# EAGLE design tx-slim-2.4g (EAGLE 9.5.2)
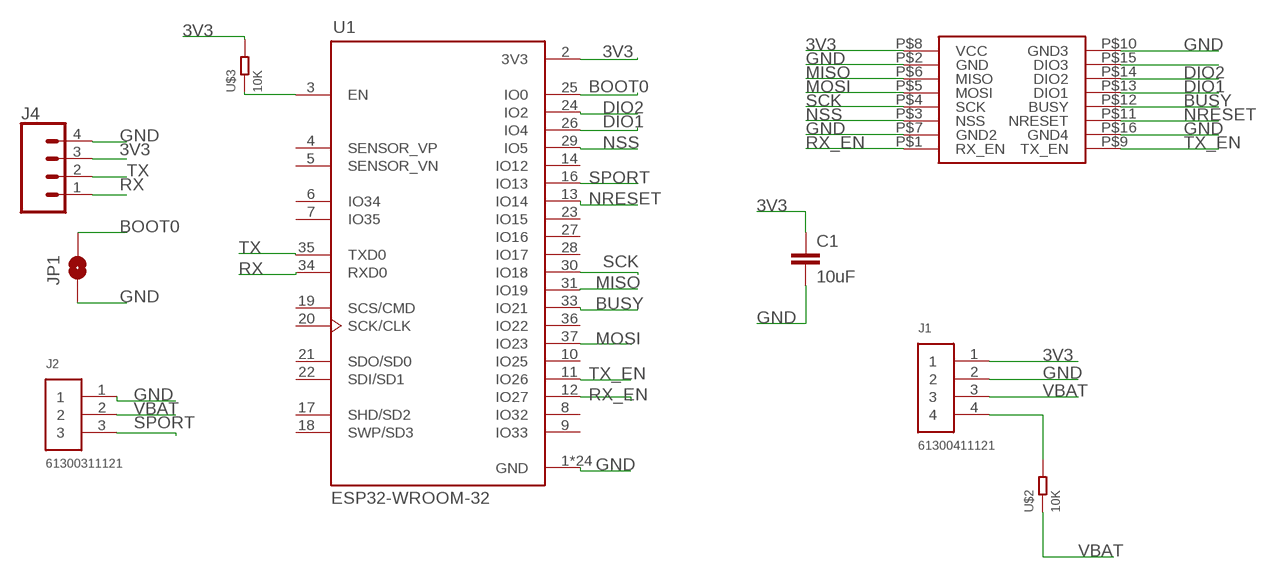
[diagram p0: schematic, sheet 1]

## Parts
C1  10uF  10UF-1210-50V-20%  [1210]
J1  61300411121  [61300411121]
J2  61300311121  [61300311121]
J4  CONN_04SMD_RA_FEMALE  [1X04_SMD_RA_FEMALE]
JP1  JUMPER-SMT_2_NO_NO-SILK  [SMT-JUMPER_2_NO_NO-SILK]
U1  ESP32-WROOM-32  [MODULE_ESP32-WROOM-32]
U$1  E28  [E28]
U$2  10K  SMD-RES-10K-1%-1/8W(0805)  [R0805]
U$3  10K  SMD-RES-10K-1%-1/8W(0805)  [R0805]

## Nets
3V3 [power]: C1.1 J1.1 J4.3 U1.2(3V3) U$1.P$8(VCC) U$3.2
BOOT0: JP1.2 U1.25(IO0)
BUSY: U1.33(IO21) U$1.P$12(BUSY)
DIO1: U1.26(IO4) U$1.P$13(DIO1)
DIO2: U1.24(IO2) U$1.P$14(DIO2)
GND [power]: C1.2 J1.2 J2.1 J4.4 JP1.1 U1.1(GND) U1.15(GND) U1.38(GND) U1.39_1(GND) U1.39_2(GND) U1.39_3(GND) U1.39_4(GND) U1.39_5(GND) U1.39_6(GND) U1.39_7(GND) U1.39_8(GND) U1.39_9(GND) U1.39_10(GND) U1.39_11(GND) U1.39_12(GND) U1.39_13(GND) U1.39_14(GND) U1.39_15(GND) U1.39_16(GND) U1.39_17(GND) U1.39_18(GND) U1.39_19(GND) U1.39_20(GND) U1.39_21(GND) U$1.P$2(GND) U$1.P$7(GND2) U$1.P$10(GND3) U$1.P$16(GND4)
MISO: U1.31(IO19) U$1.P$6(MISO)
MOSI: U1.37(IO23) U$1.P$5(MOSI)
N$4: J1.4 U$2.2
N$5: U1.3(EN) U$3.1
N$11: U$1.P$15(DIO3)
NRESET: U1.13(IO14) U$1.P$11(NRESET)
NSS: U1.29(IO5) U$1.P$3(NSS)
RX: J4.1 U1.34(RXD0)
RX_EN: U1.12(IO27) U$1.P$1(RX_EN)
SCK: U1.30(IO18) U$1.P$4(SCK)
SPORT: J2.3 U1.16(IO13)
TX: J4.2 U1.35(TXD0)
TX_EN: U1.11(IO26) U$1.P$9(TX_EN)
VBAT [power]: J1.3 J2.2 U$2.1
Unconnected: U1.4(SENSOR_VP) U1.5(SENSOR_VN) U1.6(IO34) U1.7(IO35) U1.8(IO32) U1.9(IO33) U1.10(IO25) U1.14(IO12) U1.17(SHD/SD2) U1.18(SWP/SD3) U1.19(SCS/CMD) U1.20(SCK/CLK) U1.21(SDO/SD0) U1.22(SDI/SD1) U1.23(IO15) U1.27(IO16) U1.28(IO17) U1.36(IO22)

## Library data of the parts
C1 = SparkFun-Capacitors:10UF: 10.0µF ceramic capacitors A capacitor is a passive two-terminal electrical component used to store electrical energy temporarily in an electric field.; PROD_ID: CAP-09824
J1 = Headers:61300411121: CONN HEADER VERT 4POS 2.54MM Manufacturer's datasheet <https://katalog.we-online.de/em/datasheet/6130xx11121.pdf>; CREATED_BY: PCBLayout.com; DIGI_KEY_PART_NUMBER: 732-5317-ND; MANUFACTURER: Wurth Electronics Inc.; MPN: 61300411121
J2 = Headers:61300311121: CONN HEADER VERT 3POS 2.54MM Manufacturer's datasheet <https://katalog.we-online.de/em/datasheet/6130xx11121.pdf>; CREATED_BY: PCBLayout.com; DIGI_KEY_PART_NUMBER: 732-5316-ND; MANUFACTURER: Wurth Electronics Inc.; MPN: 61300311121
J4 = SparkFun-Connectors:CONN_04: Multi connection point. Often used as Generic Header-pin footprint for 0.1 inch spaced/style header connections On any of the 0.1 inch spaced packages, you can populate with these: Break Away Headers - Straight <https://www.sparkfun.com/products/116> (PRT-00116) Break Away Male Headers - Right Angle <https://www.sparkfun.com/products/553> (PRT-00553) Female Headers <https://www.sparkfun.com/products/115> (PRT-00115) Break Away Headers - Machine Pin <https://www.sparkfun.com/products/117> (PRT-00117) Break Away Female Headers - Swiss Machine Pin <https://www.sparkfun.com/products/743> (PRT-00743) For SCREWTERMINALS and SPRING TERMINALS visit here: Screw Terimnals on SparkFun.com <https://www.sparkfun.com/search/results?term=Screw+Terminals> (5mm/3.5mm/2.54mm spacing) This device is also useful as a general connection point to wire up your design to another part of your project. Our various solder wires solder well into these plated through hole pads. Hook-Up Wire - Assortment (Stranded, 22 AWG) <https://www.sparkfun.com/products/11375> (PRT-11375) Hook-Up Wire - Assortment (Solid Core, 22 AWG) <https://www.sparkfun.com/products/11367> (PRT-11367) View the entire wire category on our website here <https://www.sparkfun.com/categories/141> Special notes: Molex polarized connector foot print use with SKU : PRT-08231 with associated crimp pins and housings. 1MM SMD Version SKU: PRT-10208; PROD_ID: CONN-12382
JP1 = SparkFun-Jumpers:JUMPER-SMT_2_NO: Normally open jumper This jumper has two pads in close proximity to each other. Apply solder to close the connection. Round pads are easier to solder for beginners, but are a lot larger. SparkFun Product that uses the round pads: SparkFun EL Sequencer <https://www.sparkfun.com/products/12781>
U1 = ESP32-WROOM-32:ESP32-WROOM-32: Bluetooth, WiFi Transceiver Module 2.4GHz ~ 2.5GHz Surface Mount Check prices <https://snapeda.com/parts/ESP32-WROOM-32/Espressif%20Systems/view-part/?ref=eda>; AVAILABILITY: Warning; DESCRIPTION: Bluetooth, WiFi Transceiver Module 2.4GHz ~ 2.5GHz Surface Mount; DIGIKEY-PURCHASE-URL: https://snapeda.com/shop?store=DigiKey&id=2753322; MF: Espressif Systems; MP: ESP32-WROOM-32; PACKAGE: Module Espressif Systems; PRICE: None
U$1 = e28:E28
U$2 U$3 = OPL_Resistor:SMD-RES-10K-1%-1/8W(0805): 301012152; MPN: RC0805FR-0710KL

## Net classes
0 default: width 0.203 mm
1 power: width 0.406 mm

## Board
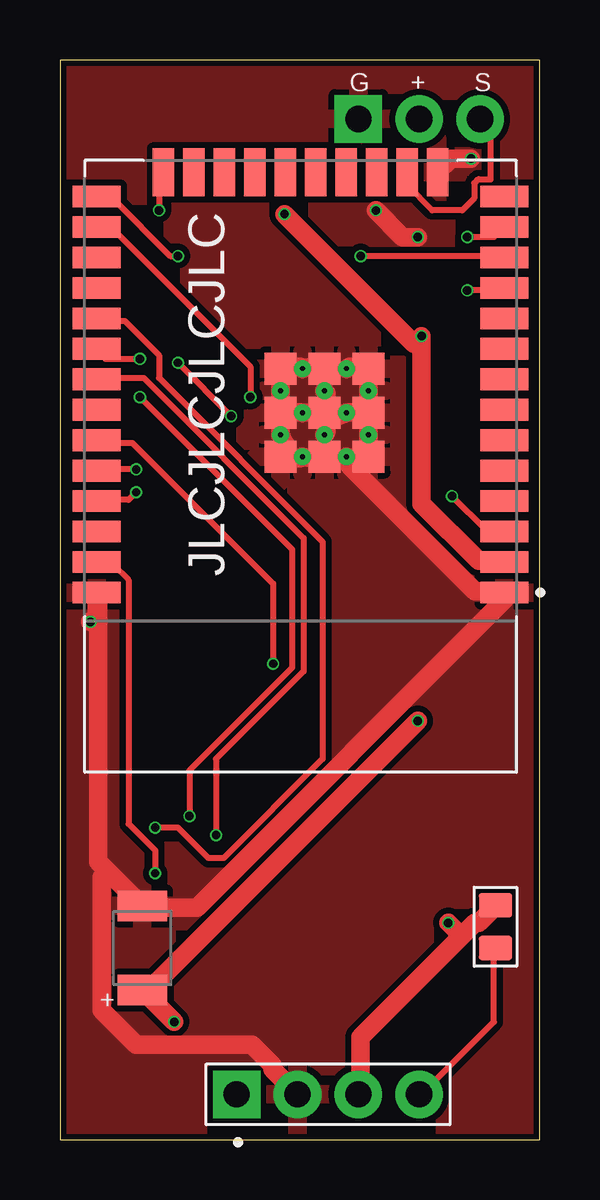
[diagram p1: board, top side]
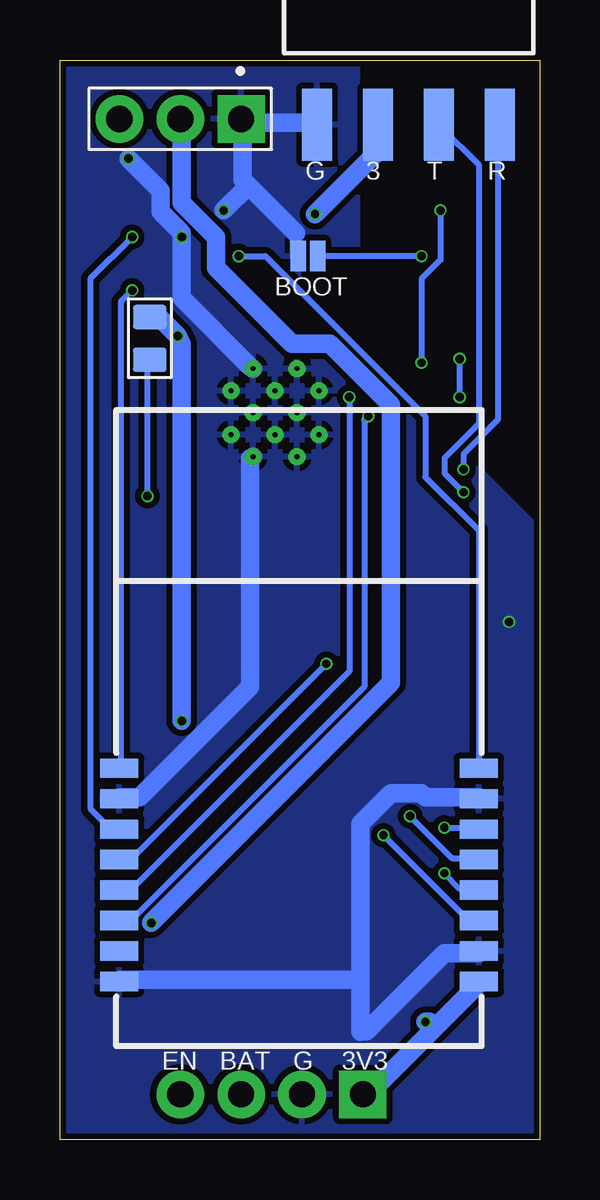
[diagram p2: board, bottom side, seen from below]

Size 20 x 45 mm. Coordinates in mm from the lower left corner, seen from the top.
Outline: 0,0 20,0 20,45 0,45 0,0
Copper layers (1*16): Top 0.035mm / dielectric 1.6mm / Bottom 0.035mm
Design rules "jlcpcb-2layers": minimum track width 5mil, minimum drill 0.3mm, track to track 5mil, track to pad 5mil, pad to pad 5mil, via to via 5mil, smd to smd 5mil, copper to edge 0.2mm, drill to drill 6mil, minimum pad ring 10mil, minimum via ring 3mil, stop-mask expansion 4mil, vias tented up to drill 0mil, thermal gap 10mil

### Footprints (pad centres in the part's own frame; a part is rotated, then mirrored left to right if it is on the bottom)
1210 = smd 1.27 x 2.06: 1 -1.755,0; 2 1.755,0
61300411121 = drill 1.1 square: 1 -3.81,0 | drill 1.1: 2 -1.27,0; 3 1.27,0; 4 3.81,0
61300311121 = drill 1.1 square: 1 -2.54,0 | drill 1.1: 2 0,0; 3 2.54,0
1X04_SMD_RA_FEMALE = smd 1.25 x 3: 1 -3.81,7.225; 2 -1.27,7.225; 3 1.27,7.225; 4 3.81,7.225
SMT-JUMPER_2_NO_NO-SILK = smd 0.635 x 1.27: 1 -0.406,0; 2 0.406,0
MODULE_ESP32-WROOM-32 = smd 2 x 0.9: 1 -8.5,5.26; 2 -8.5,3.99; 3 -8.5,2.72; 4 -8.5,1.45; 5 -8.5,0.18; 6 -8.5,-1.09; 7 -8.5,-2.36; 8 -8.5,-3.63; 9 -8.5,-4.9; 10 -8.5,-6.17; 11 -8.5,-7.44; 12 -8.5,-8.71; 13 -8.5,-9.98; 14 -8.5,-11.25; 25 8.5,-11.25; 26 8.5,-9.98; 27 8.5,-8.71; 28 8.5,-7.44; 29 8.5,-6.17; 30 8.5,-4.9; 31 8.5,-3.63; 32 8.5,-2.36; 33 8.5,-1.09; 34 8.5,0.18; 35 8.5,1.45; 36 8.5,2.72; 37 8.5,3.99; 38 8.5,5.26 | smd 0.9 x 2: 15 -5.715,-12.25; 16 -4.445,-12.25; 17 -3.175,-12.25; 18 -1.905,-12.25; 19 -0.635,-12.25; 20 0.635,-12.25; 21 1.905,-12.25; 22 3.175,-12.25; 23 4.445,-12.25; 24 5.715,-12.25 | smd 1.33 x 1.33: 39_1 -2.835,-0.405; 39_2 -1,-0.405; 39_3 0.835,-0.405; 39_4 -2.835,-2.24; 39_5 -1,-2.24; 39_6 0.835,-2.24; 39_7 -2.835,-4.075; 39_8 -1,-4.075; 39_9 0.835,-4.075 | drill 0.2 pad 0.3: 39_10 -1.917,-0.405; 39_11 -0.083,-0.405; 39_12 -2.835,-1.323; 39_13 -1,-1.323; 39_14 0.835,-1.323; 39_15 -1.917,-2.24; 39_16 -0.083,-2.24; 39_17 -2.835,-3.158; 39_18 -1,-3.158; 39_19 0.835,-3.158; 39_20 -1.917,-4.075; 39_21 -0.083,-4.075
E28 = smd 1.6 x 0.8: P$1 -7.5,-4.445; P$2 -7.5,-3.175; P$3 -7.5,-1.905; P$4 -7.5,-0.635; P$5 -7.5,0.635; P$6 -7.5,1.905; P$7 -7.5,3.175; P$8 -7.5,4.445; P$9 7.5,-4.445; P$10 7.5,-3.175; P$11 7.5,-1.905; P$12 7.5,-0.635; P$13 7.5,0.635; P$14 7.5,1.905; P$15 7.5,3.175; P$16 7.5,4.445
R0805 = smd 1.397 x 1.016: 1 0,0.889; 2 0,-0.889

### Placement (x,y rotation side)
C1  3.43,8 90 top
J1  11.18,1.91 0 top
J2  14.99,42.55 180 bottom
J4  5.46,49.53 180 bottom
JP1  9.65,36.83 0 bottom
U1  10.03,28.07 180 top
U$1  10.03,11.05 180 bottom
U$2  18.16,8.89 0 top
U$3  16.26,33.4 180 bottom

### Tracks (layer width: path | path; a pad name or v marks a point on that pad's centre or on a via)
3V3  (via drill 0.35)
  Top 0.762: v4.76,4.92 3.49,6.19 C1.1 3.81,6.35 v14.92,17.46 | 15.08,33.18 15.08,26.51 17.46,24.13 18.41,24.13 U1.2 | 15.08,33.18 v15.08,33.5 | v9.37,38.58 14.76,33.18 15.08,33.18
  Bottom 0.762: 4.37,4.68 7.14,1.91 J1.1 | 4.37,4.68 2.54,6.51 U$1.P$8 | v4.76,4.92 4.6,4.92 4.37,4.68 | U$3.2 15.88,34.29 v15.08,33.5 14.92,33.18 v14.92,17.46 | v9.37,38.58 6.83,41.12 6.83,42.23 J4.3
BOOT0  (via drill 0.35)
  Top 0.254: v4.92,36.83 4.6,36.83 2.22,39.21 1.59,39.21 U1.25
  Bottom 0.254: v4.92,36.83 JP1.2
BUSY  (via drill 0.35)
  Top 0.254: v8.89,19.84 8.89,23.18 3.02,29.05 1.59,29.05 U1.33
  Bottom 0.254: v8.89,19.84 16.99,11.75 17.46,11.75 U$1.P$12
DIO1  (via drill 0.35)
  Top 0.254: v7.94,30.96 7.94,32.23 2.22,37.94 1.59,37.94 U1.26
  Bottom 0.254: v7.94,30.96 7.94,19.53 16.99,10.48 17.46,10.48 U$1.P$13
DIO2  (via drill 0.35)
  Top 0.254: v4.92,32.38 v7.14,30.16 | v4.13,38.73 4.13,40.01 4.29,40.16 U1.24
  Bottom 0.254: v7.14,30.16 7.3,30 7.3,18.89 16.99,9.21 17.46,9.21 U$1.P$14 | v4.92,32.38 4.92,35.88 4.13,36.67 v4.13,38.73
GND  (via drill 0.35)
  Top 0.762: 1.98,11.19 3.33,9.84 C1.2 3.81,9.68 5.71,9.68 18.57,22.54 U1.1 18.41,22.86 17.3,22.86 12.06,28.1 12.06,28.42 | 1.98,11.19 1.59,11.59 1.59,22.7 U1.38 1.53,21.85 v1.27,21.59 | U1.39_5 11.11,30.16 11.11,29.53 U1.39_13 | U1.39_18 11.11,31.11 11.11,30.64 U1.39_5 | U1.39_20 12.06,32.23 12.86,32.23 U1.39_7 12.86,31.91 12.86,31.59 U1.39_17 12.86,31.11 12.86,30.64 U1.39_4 | U1.39_4 12.86,30.16 12.86,29.53 U1.39_12 12.86,29.05 12.86,28.73 U1.39_1 12.86,28.42 12.06,28.42 | U1.39_4 12.54,30.32 12.06,30.32 U1.39_15 11.59,30.16 11.43,30.16 U1.39_5 | U1.39_8 10.95,32.23 10.48,32.23 U1.39_21 10,32.23 9.21,32.23 U1.39_9 9.21,31.91 9.21,31.59 U1.39_19 9.21,31.11 9.21,30.64 U1.39_6 | U1.39_2 10.95,28.42 10.48,28.42 U1.39_11 10,28.42 9.21,28.42 U1.39_3 9.37,28.73 9.37,29.05 U1.39_14 9.21,29.53 9.21,30.16 U1.39_6 | U1.39_6 9.53,30.32 10,30.32 U1.39_16 10.48,30.32 10.64,30.32 U1.39_5 | 12.06,28.42 U1.39_10 | 1.98,11.19 1.75,10.95 1.75,5.4 3.17,3.97 8,3.97 8.86,3.1 8.86,2.95 J1.2 | v14.92,37.62 14.29,37.62 v13.18,38.73 | v17.14,40.89 16.32,40.89 U1.15
  Bottom 0.508: JP1.1 10.16,36.93 10.16,37.78
  Bottom 0.762: U$1.P$7 2.54,7.78 3.97,7.78 7.22,4.52 7.46,4.76 | 7.46,4.76 7.46,6.67 | 7.46,6.67 7.46,13.18 6.19,14.45 4.92,14.45 4.76,14.29 2.54,14.29 U$1.P$2 | 7.46,6.67 17.46,6.67 U$1.P$16 | 12.14,39.77 12.38,40.01 12.38,42.55 J2.1 12.06,42.39 9.37,42.39 J4.4 | 10.16,37.78 12.14,39.77 | 12.14,39.77 v13.18,38.73 | U$1.P$10 17.46,14.29 16.67,14.29 12.06,18.89 12.06,28.42 U1.39_10 | U1.39_20 12.06,32.23 14.92,35.08 v14.92,37.62 14.92,37.8 15.81,38.68 15.81,39.56 v17.14,40.89 | J1.2 9.91,2.06 | 7.46,4.51 7.46,4.76
  pour Bottom (isolate 0.254): 2.54,27.94 -2.54,22.86 -2.54,-1.27 21.59,-1.27 21.59,45.72 7.62,45.72 7.62,33.02
  pour Top (isolate 0.254): 0,44.45 0,0 20.32,0 20.32,44.45
MISO  (via drill 0.35)
  Top 0.254: v6.51,12.7 6.51,15.88 10.16,19.53 10.16,25.08 3.49,31.75 1.59,31.75 U1.31
  Bottom 0.254: v6.51,12.7 3.02,9.21 2.54,9.21 U$1.P$6
MOSI  (via drill 0.35)
  Top 0.254: v3.97,11.11 3.97,12.06 2.86,13.18 2.86,23.34 2.22,23.97 1.59,23.97 U1.37
  Bottom 0.254: v3.97,11.11 3.33,10.48 2.54,10.48 U$1.P$5
N$4
  Top 0.254: U$2.2 18.1,7.94 18.1,4.92 15.08,1.91 J1.4
N$5  (via drill 0.35)
  Top 0.254: v16.35,26.83 17.78,25.4 18.41,25.4 U1.3
  Bottom 0.254: v16.35,26.83 16.35,32.38 U$3.1
NRESET  (via drill 0.35)
  Top 0.254: v16.99,37.62 18.1,37.62 18.41,37.94 U1.13
  Bottom 0.254: v16.99,37.62 18.73,35.88 18.73,13.81 17.94,13.02 17.62,13.02 U$1.P$11
NSS  (via drill 0.35)
  Top 0.254: v3.97,13.02 4.92,13.02 6.19,11.75 6.83,11.75 10.95,15.88 10.95,24.92 4.13,31.75 4.13,32.7 2.7,34.13 1.59,34.13 U1.29
  Bottom 0.254: v3.97,13.02 2.54,13.02 U$1.P$3
RX  (via drill 0.35)
  Top 0.254: v3.17,27.94 1.59,27.94 U1.34
  Bottom 0.254: v3.17,27.94 3.17,28.57 1.75,30 1.75,42.23 J4.1
RX_EN  (via drill 0.35)
  Top 0.254: v12.54,36.83 18.41,36.83 U1.12
  Bottom 0.254: v12.54,36.83 11.43,36.83 4.76,30.16 4.76,27.62 2.54,25.4 2.54,15.56 U$1.P$1
SCK  (via drill 0.35)
  Top 0.254: v5.4,13.49 5.4,15.4 9.68,19.68 9.68,24.61 v3.33,30.96 | v3.33,32.54 1.91,32.54 1.59,32.86 U1.30
  Bottom 0.254: v5.4,13.49 3.65,11.75 2.54,11.75 U$1.P$4 | v3.33,32.54 v3.33,30.96
SPORT
  Top 0.254: J2.3 17.46,42.55 17.96,42.04 17.96,40.02 17.78,40.02 17.5,40.02 17.43,40.02 17.27,39.87 17.27,39.23 16.77,38.73 15.52,38.73 14.51,39.75 14.48,39.75 U1.16
TX  (via drill 0.35)
  Top 0.254: v3.17,26.99 2.86,26.67 1.59,26.67 U1.35
  Bottom 0.254: v3.17,26.99 3.97,27.78 3.97,28.42 2.54,29.84 2.54,40.64 4.13,42.23 J4.2
TX_EN  (via drill 0.35)
  Top 0.254: v16.99,35.4 18.41,35.4 U1.11
  Bottom 0.254: v16.99,35.4 17.46,34.92 17.46,15.56 U$1.P$9
VBAT  (via drill 0.35)
  Top 0.762: 16.75,8.49 12.54,4.29 12.54,1.91 J1.3 | 16.75,8.49 17.3,9.05 17.46,9.05 18.1,9.68 U$2.1 | 16.75,8.49 v16.19,9.05
  Bottom 0.762: v16.19,9.05 6.19,19.05 6.19,30.64 8.73,33.18 10.32,33.18 13.49,36.35 13.49,37.62 14.92,39.05 14.92,42.55 J2.2

### Text on the board
tNames: G | + | S | JLCJLCJLCJLC | +
bNames: R | T | 3 | G | BOOT | 3V3 | G | BAT | EN